# Altium schematic sheet PowerSupply.SchDoc
size A3; SheetNumber: 2; SheetTotal: 3
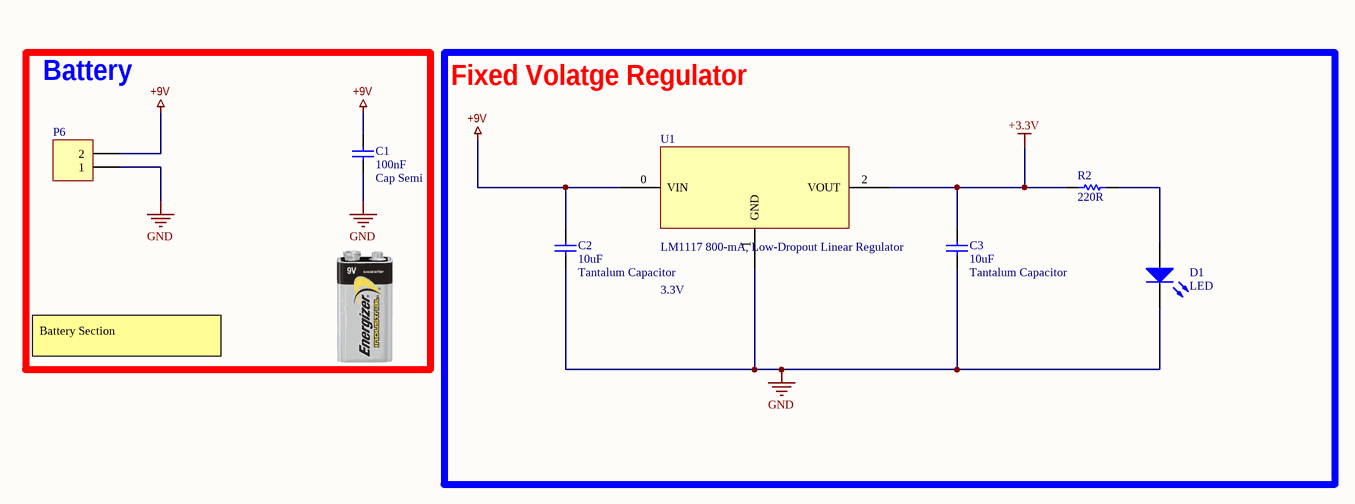
[diagram p0: PowerSupply.SchDoc]

## Parts
C1  Cap Semi  value 100nF  [C1206]
C2  Tantalum Capacitor  value 10uF  [C1206]
C3  Tantalum Capacitor  value 10uF  [C1206]
D1  LED  [MY_LED_0805]
P6  Header 2  [My_1X02]  (value not drawn)
R2  220R  [MY_0805]
U1  LM1117 800-mA, Low-Dropout Linear Regulator  Voltage: 3.3V  [4-pin SOT]

## Blocks framed on the sheet
Battery: C1 P6
Fixed Volatge Regulator: C2 C3 D1 R2 U1

## Nets
+3.3V: C3.2 R2.1 U1.2(VOUT)
+9V: C1.2 C2.2 P6.2 U1.0(VIN)
GND: C1.1 C2.1 C3.1 D1.K P6.1 U1.1(GND)
NetD1_A: D1.A R2.2

## Notes on the sheet
- Battery Section

## Library data of the parts
C1-C3 = Cap Semi: Capacitor (Semiconductor SIM Model); Published: 8-Jun-2000; LatestRevisionDate: 29-May-2009; LatestRevisionNote: IPC-7351 Footprint Added.; PackageReference: C1206; Publisher: Altium Limited; PackageDescription: Chip Capacitor
D1 = LED: Typical INFRARED GaAs LED; ASiD Part Number: LED-AS
P6 = Header 2: Header, 2-Pin; ASiD Part Number: Header 2-AS
R2 = Res: Standard resistor; ASiD Part Number: Res-AS; Value: 220R
U1 = lm1117: The LM1117 is a low dropout voltage regulator with a / dropout of 1.2 V at 800 mA of load current. / The LM1117 is available in an adjustable version, / which can set the output voltage from 1.25 V to 13.8 V / with only two external resistors. In addition, the device / is available in five fixed voltages, 1.8 V, 2.5 V, 3.3 V, / and 5 V. / The LM1117 offers current limiting and thermal / shutdown. The circuit includes a Zener trimmed bandgap reference to assure output voltage accuracy to / within ±1%. / A minimum of 10-µF tantalum capacitor is required / at the output to improve the transient response and / stability.; Manufacturer: Texas Instruments (TI); Component Name: lm1117; Datasheet: https://www.ti.com/lit/ds/symlink/lm1117.pdf